# EAGLE board BMS_Master (EAGLE 7.2.0)
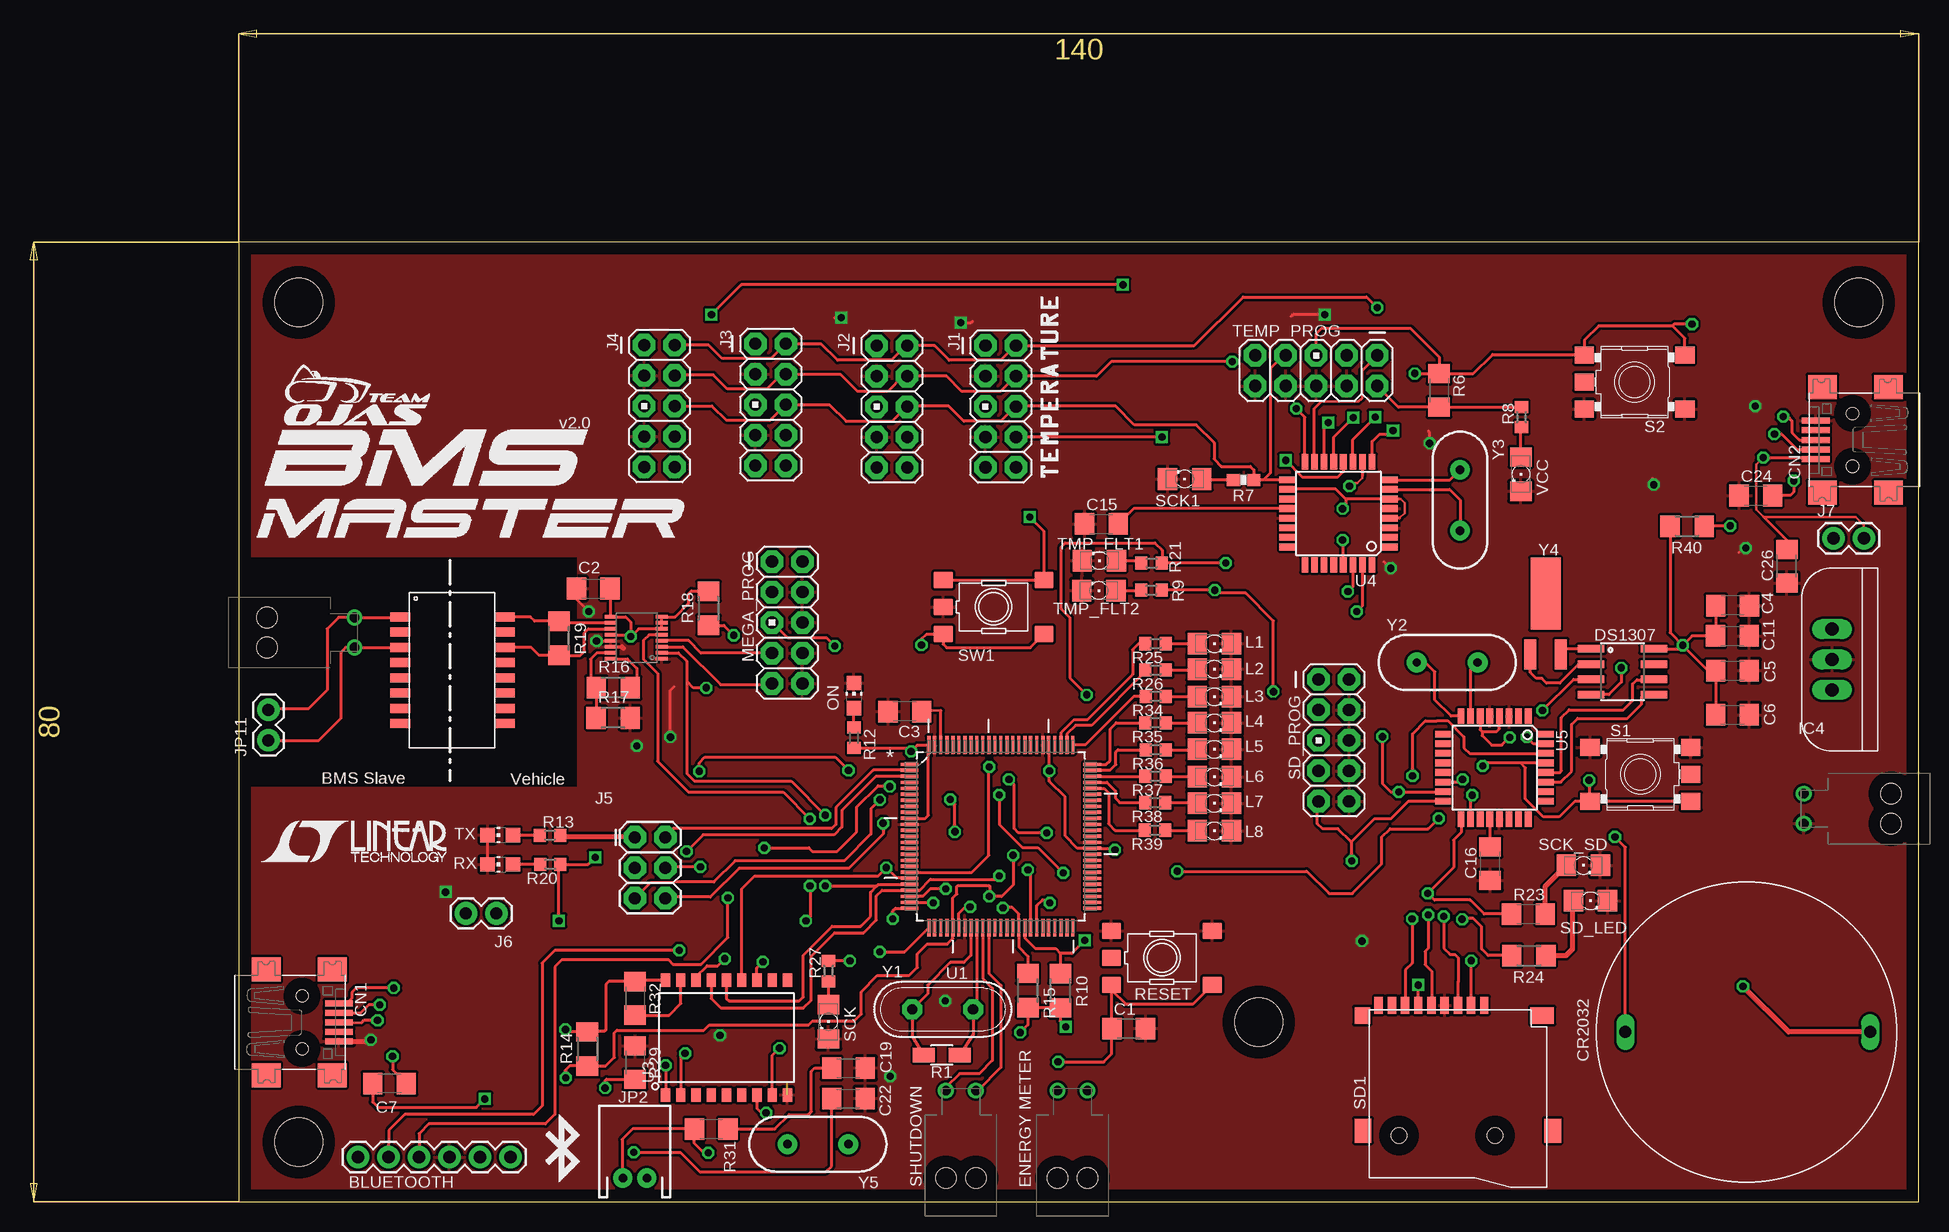
[diagram p5: board, top side]
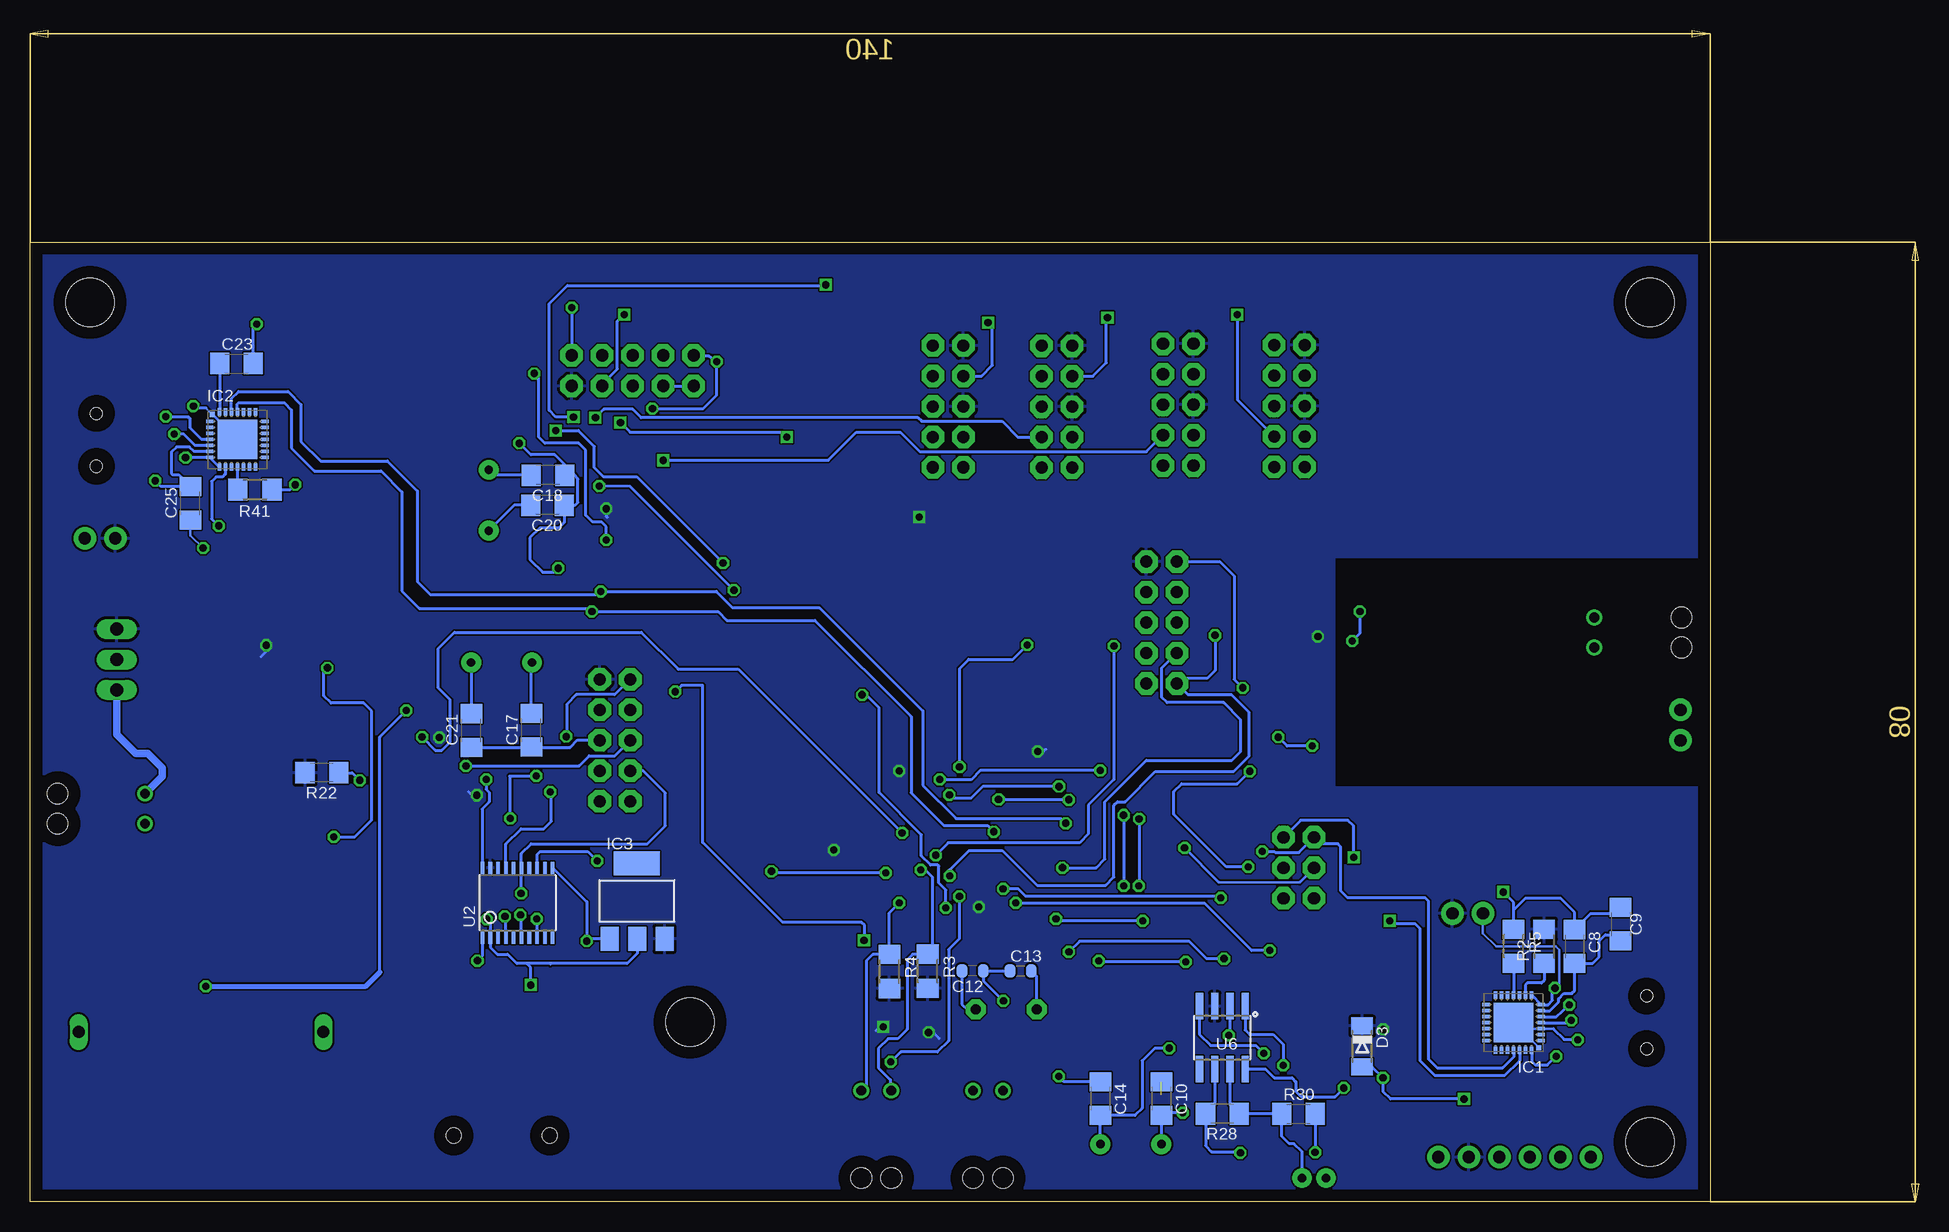
[diagram p6: board, bottom side, seen from below]

Size 140 x 80 mm. Coordinates in mm from the lower left corner, seen from the top.
Outline: 0,0 140,0 140,80 0,80 0,0
Copper layers (1*16): Top 0.035mm / dielectric 1.5mm / Bottom 0.035mm
Design rules "default *": minimum track width 0.253mm, minimum drill 0.59mm, track to track 6mil, track to pad 6mil, pad to pad 6mil, via to via 6mil, smd to smd 6mil, copper to edge 40mil, drill to drill 8mil, minimum pad ring 10mil, minimum via ring 8mil, stop-mask expansion 4mil, vias tented up to drill 0mil, thermal gap 10mil
Net classes: 1 vcc: width 0.254 mm; 2 gnd: width 0.305 mm, drill 0.406 mm, clearance 0.203 mm; 3 power usb: width 0.508 mm, drill 0.406 mm, clearance 0.203 mm
Holes 4 mm at 5,5 135,75 5,75 85,15

## Footprints (pad centres in the part's own frame; a part is rotated, then mirrored left to right if it is on the bottom)
1X06 = drill 1.016 pad 1.88: 1 0,0; 2 2.54,0; 3 5.08,0; 4 7.62,0; 5 10.16,0; 6 12.7,0
C1206 = smd 1.6 x 1.8: 1 -1.4,0; 2 1.4,0
1206 = smd 1.6 x 1.8: 1 -1.4,0; 2 1.4,0
C0603-ROUND = smd 0.898 x 1.1: 1 -0.889,0; 2 0.889,0
USB-MINIB = smd 0.5 x 2.308: D+ 0,4.064; D- -0.8,4.064; GND 1.6,4.064; ID 0.8,4.064; VBUS -1.6,4.064 | smd 2 x 2.4: GND1 -4.4,-2; GND2 -4.4,3.5; GND3 4.4,3.5; GND4 4.4,-2 | hole 1: -2.2,1; 2.2,1
CR2032 = drill 1 long: P$1 -10.3,0; P$2 10.1,0
MINIMELF = smd 1.4 x 1.8: A 1.7,0; C -1.7,0
SO08 = smd 0.61 x 2.21: 1 -1.905,-2.616; 2 -0.635,-2.616; 3 0.635,-2.616; 4 1.905,-2.616; 5 1.905,2.616; 6 0.635,2.616; 7 -0.635,2.616; 8 -1.905,2.616
MLP28 = smd 0.6 x 0.3: 1 -2.3,1.5; 2 -2.3,1; 3 -2.3,0.5; 4 -2.3,0; 5 -2.3,-0.5; 6 -2.3,-1; 7 -2.3,-1.5; 15 2.3,-1.5; 16 2.3,-1; 17 2.3,-0.5; 18 2.3,0; 19 2.3,0.5; 20 2.3,1; 21 2.3,1.5 | smd 0.3 x 0.6: 8 -1.5,-2.3; 9 -1,-2.3; 10 -0.5,-2.3; 11 0,-2.3; 12 0.5,-2.3; 13 1,-2.3; 14 1.5,-2.3; 22 1.5,2.3; 23 1,2.3; 24 0.5,2.3; 25 0,2.3; 26 -0.5,2.3; 27 -1,2.3; 28 -1.5,2.3 | smd 3.3 x 3.3: EXP 0,0 | smd 0.435 x 0.435: M -2.103,2.103
SOT223 = smd 1.499 x 2.007: 1 -2.261,-3.15; 2 0.025,-3.15; 3 2.311,-3.15 | smd 3.81 x 2.007: 4 0,3.15
TO220H = drill 1.118 long: 1 -2.54,0; 2 0,0; 3 2.54,0
AVR_ICSP = drill 1.016 pad 1.88 octagon: 1 -1.27,5.08; 2 1.27,5.08; 3 -1.27,2.54; 4 1.27,2.54; 5 -1.27,0; 6 1.27,0; 7 -1.27,-2.54; 8 1.27,-2.54; 9 -1.27,-5.08; 10 1.27,-5.08
2X3 = drill 1.016 pad 1.88 octagon: 1 0,0; 2 0,2.54; 3 2.54,0; 4 2.54,2.54; 5 5.08,0; 6 5.08,2.54
1X02 = drill 1.016 pad 1.88: 1 0,0; 2 2.54,0
JST-2-PTH = drill 0.7 pad 1.6: 1 -1,0; 2 1,0
LED_1206 = smd 1.6 x 1.803: A -1.422,0; C 1.422,0
CHIP-LED0805 = smd 1.2 x 1.2: A 0,-1.05; C 0,1.05
R1206W = smd 1.8 x 1.2: 1 -1.499,0; 2 1.499,0
R1206 = smd 1.6 x 1.803: 1 -1.422,0; 2 1.422,0
0603-RES = smd 1.1 x 1: 1 -0.85,0; 2 0.85,0
R0603 = smd 1 x 1.1: 1 -0.85,0; 2 0.85,0
TS42 = smd 1.6 x 1.4: 1 -4.2,2.25; 2 4.2,2.25; 3 -4.2,-2.25; 4 4.2,-2.25; 5 -4.2,0
SKHMPXE010 = smd 1.6 x 1.4: 1 -4.2,2.25; 2 4.2,2.25; 3 -4.2,-2.25; 4 4.2,-2.25; 5 4.2,0
TF-PULL = smd 0.7 x 1.4: 1 -2.2,-7.62; 2 -1.1,-7.62; 3 0,-7.62; 4 1.1,-7.62; 5 2.2,-7.62; 6 3.3,-7.62; 7 4.4,-7.62; 8 5.5,-7.62; 9 6.6,-7.62 | smd 1.4 x 2: S1 -7.9,2.85; S2 7.9,2.85 | smd 1.28 x 1.4: S3 7.96,-6.75 | smd 1.95 x 1.4: S4 -7.025,-6.75 | hole 1.25: -3.1,3.25; 4.9,3.25
QFP50P1600X1600X120-100N = smd 1.473 x 0.279: 1 -7.62,5.994; 2 -7.62,5.512; 3 -7.62,5.004; 4 -7.62,4.496; 5 -7.62,3.988; 6 -7.62,3.505; 7 -7.62,2.997; 8 -7.62,2.489; 9 -7.62,2.007; 10 -7.62,1.499; 11 -7.62,0.991; 12 -7.62,0.508; 13 -7.62,0; 14 -7.62,-0.508; 15 -7.62,-0.991; 16 -7.62,-1.499; 17 -7.62,-2.007; 18 -7.62,-2.489; 19 -7.62,-2.997; 20 -7.62,-3.505; 21 -7.62,-3.988; 22 -7.62,-4.496; 23 -7.62,-5.004; 24 -7.62,-5.512; 25 -7.62,-5.994; 51 7.62,-5.994; 52 7.62,-5.512; 53 7.62,-5.004; 54 7.62,-4.496; 55 7.62,-3.988; 56 7.62,-3.505; 57 7.62,-2.997; 58 7.62,-2.489; 59 7.62,-2.007; 60 7.62,-1.499; 61 7.62,-0.991; 62 7.62,-0.508; 63 7.62,0; 64 7.62,0.508; 65 7.62,0.991; 66 7.62,1.499; 67 7.62,2.007; 68 7.62,2.489; 69 7.62,2.997; 70 7.62,3.505; 71 7.62,3.988; 72 7.62,4.496; 73 7.62,5.004; 74 7.62,5.512; 75 7.62,5.994 | smd 0.279 x 1.473: 26 -5.994,-7.62; 27 -5.512,-7.62; 28 -5.004,-7.62; 29 -4.496,-7.62; 30 -3.988,-7.62; 31 -3.505,-7.62; 32 -2.997,-7.62; 33 -2.489,-7.62; 34 -2.007,-7.62; 35 -1.499,-7.62; 36 -0.991,-7.62; 37 -0.508,-7.62; 38 0,-7.62; 39 0.508,-7.62; 40 0.991,-7.62; 41 1.499,-7.62; 42 2.007,-7.62; 43 2.489,-7.62; 44 2.997,-7.62; 45 3.505,-7.62; 46 3.988,-7.62; 47 4.496,-7.62; 48 5.004,-7.62; 49 5.512,-7.62; 50 5.994,-7.62; 76 5.994,7.62; 77 5.512,7.62; 78 5.004,7.62; 79 4.496,7.62; 80 3.988,7.62; 81 3.505,7.62; 82 2.997,7.62; 83 2.489,7.62; 84 2.007,7.62; 85 1.499,7.62; 86 0.991,7.62; 87 0.508,7.62; 88 0,7.62; 89 -0.508,7.62; 90 -0.991,7.62; 91 -1.499,7.62; 92 -2.007,7.62; 93 -2.489,7.62; 94 -2.997,7.62; 95 -3.505,7.62; 96 -3.988,7.62; 97 -4.496,7.62; 98 -5.004,7.62; 99 -5.512,7.62; 100 -5.994,7.62
TSSOP20 = smd 0.305 x 0.991: 1 -2.925,-2.918; 2 -2.275,-2.918; 3 -1.625,-2.918; 4 -0.975,-2.918; 5 -0.325,-2.918; 6 0.325,-2.918; 7 0.975,-2.918; 8 1.625,-2.918; 9 2.275,-2.918; 10 2.925,-2.918; 11 2.925,2.918; 12 2.275,2.918; 13 1.625,2.918; 14 0.975,2.918; 15 0.325,2.918; 16 -0.325,2.918; 17 -0.975,2.918; 18 -1.625,2.918; 19 -2.275,2.918; 20 -2.925,2.918
SO-18W = smd 0.762 x 1.143: 1 -5.08,-4.788; 2 -3.81,-4.788; 3 -2.54,-4.788; 4 -1.27,-4.788; 5 0,-4.788; 6 1.27,-4.788; 7 2.54,-4.788; 8 3.81,-4.788; 9 5.08,-4.788; 10 5.08,4.788; 11 3.81,4.788; 12 2.54,4.788; 13 1.27,4.788; 14 0,4.788; 15 -1.27,4.788; 16 -2.54,4.788; 17 -3.81,4.788; 18 -5.08,4.788
TQFP32-08 = smd 1.27 x 0.559: 1 -4.293,2.8; 2 -4.293,2; 3 -4.293,1.2; 4 -4.293,0.4; 5 -4.293,-0.4; 6 -4.293,-1.2; 7 -4.293,-2; 8 -4.293,-2.8; 17 4.293,-2.8; 18 4.293,-2; 19 4.293,-1.2; 20 4.293,-0.4; 21 4.293,0.4; 22 4.293,1.2; 23 4.293,2; 24 4.293,2.8 | smd 0.559 x 1.27: 9 -2.8,-4.293; 10 -2,-4.293; 11 -1.2,-4.293; 12 -0.4,-4.293; 13 0.4,-4.293; 14 1.2,-4.293; 15 2,-4.293; 16 2.8,-4.293; 25 2.8,4.293; 26 2,4.293; 27 1.2,4.293; 28 0.4,4.293; 29 -0.4,4.293; 30 -1.2,4.293; 31 -2,4.293; 32 -2.8,4.293
MOLEX_2PIN = drill 0.8 pad 1.2: P$1 1.72,10.48; P$2 4.22,10.48 | hole 1.7: 1.72,3.2; 4.22,3.2
LTC6820 = smd 0.305 x 1: 1 1.711,2.235; 2 1.211,2.235; 3 0.711,2.235; 4 0.211,2.235; 5 -0.289,2.235; 6 -0.789,2.235; 7 -1.289,2.235; 8 -1.789,2.235; 9 -1.789,-2.015; 10 -1.289,-2.015; 11 -0.789,-2.015; 12 -0.289,-2.015; 13 0.211,-2.015; 14 0.711,-2.015; 15 1.211,-2.015; 16 1.711,-2.015
HX1188 = smd 1.651 x 0.762: 1 -4.318,4.318; 2 -4.318,3.048; 3 -4.318,1.778; 4 -4.318,0.508; 5 -4.318,-0.762; 6 -4.318,-2.032; 7 -4.318,-3.302; 8 -4.318,-4.572; 9 4.402,-4.572; 10 4.402,-3.302; 11 4.402,-2.032; 12 4.402,-0.762; 13 4.402,0.508; 14 4.402,1.778; 15 4.402,3.048; 16 4.372,4.318
QS = drill 0.85 pad 1.676 octagon: 1 -2.54,0; 2 2.54,0
HC49US = drill 0.7 pad 1.651: 1 -2.54,0; 2 2.54,0
CRYSTAL-32KHZ-SMD = smd 2.5 x 6: SHEILD 0,5.08 | smd 1 x 2.5: X1 -1.27,0; X2 1.27,0

## Placement (x,y rotation side)
BLUETOOTH  [1X06]  22.63,3.74 180 top
C1  22p  [C1206]  74.16,14.46 0 top
C2  100n  [C1206]  29.54,51.14 0 top
C3  100n  [C1206]  55.5,40.88 180 top
C4  100n  [C1206]  124.46,47.19 0 top
C5  100n  [C1206]  124.47,44.29 0 top
C6  100n  [C1206]  124.48,40.61 0 top
C7  0.1uF  [C1206]  12.56,9.87 180 top
C8  0.1uF  [C1206]  11.29,21.3 270 bottom
C9  4.7uF  [C1206]  7.45,23.16 270 bottom
C10  22pF  [1206]  45.72,8.62 270 bottom
C11  100n  [C1206]  124.48,49.71 180 top
C12  15p  [C0603-ROUND]  61.45,19.26 180 bottom
C13  15p  [C0603-ROUND]  57.44,19.26 0 bottom
C14  22pF  [1206]  50.8,8.62 270 bottom
C15  0.1uF  [1206]  71.88,56.52 0 top
C16  0.1uF  [1206]  104.28,28.2 90 top
C17  22pF  [1206]  98.22,39.32 90 bottom
C18  22pF  [1206]  96.84,60.58 180 bottom
C19  560pF  [1206]  50.8,11.16 0 top
C20  22pF  [1206]  96.88,58.08 180 bottom
C21  22pF  [1206]  103.22,39.3 90 bottom
C22  560pF  [1206]  50.8,8.62 0 top
C23  0.1uF  [C1206]  122.79,69.9 0 bottom
C24  0.1uF  [C1206]  126.42,58.89 0 top
C25  4.7uF  [C1206]  126.63,58.24 90 bottom
C26  4.7uF  [C1206]  129,53 90 top
CN1  [USB-MINIB]  4.28,14.97 270 top
CN2  [USB-MINIB]  135.47,63.53 90 top
CR2032  CR2032  [CR2032]  125.65,14.17 180 top
D3  CD1206-S01575  [MINIMELF]  28.99,12.97 270 bottom
DS1307  DS1307SO8  [SO08]  115.3,44.2 270 top
IC1  CP2102  [MLP28]  16.37,14.95 180 bottom
IC2  CP2102  [MLP28]  122.71,63.56 0 bottom
IC3  REG1117  [SOT223]  89.43,25.08 0 bottom
IC4  7805T  [TO220H]  132.77,45.22 90 top
J1  [AVR_ICSP]  63.49,66.31 0 top
J2  [AVR_ICSP]  54.43,66.3 0 top
J3  [AVR_ICSP]  44.31,66.47 0 top
J4  [AVR_ICSP]  35.05,66.35 0 top
J5  FEMALE 2x3  [2X3]  33,30.39 270 top
J6  [1X02]  21.46,24.05 180 top
J7  [1X02]  132.89,55.32 0 top
JP2  [JST-2-PTH]  33,2 0 top
JP11  [1X02]  2.46,38.48 90 top
L1  [LED_1206]  81.3,46.54 0 top
L2  [LED_1206]  81.3,44.42 0 top
L3  [LED_1206]  81.3,42.12 0 top
L4  [LED_1206]  81.3,39.94 0 top
L5  [LED_1206]  81.3,37.74 0 top
L6  [LED_1206]  81.3,35.44 0 top
L7  [LED_1206]  81.3,33.24 0 top
L8  [LED_1206]  81.3,30.94 0 top
MEGA_PROG  AVR_SPI_PROG  [AVR_ICSP]  45.7,48.3 0 top
ON  GREEN  [CHIP-LED0805]  51.26,42.21 0 top
R1  1M  [R1206W]  58.58,12.24 180 top
R2  4.7k  [R1206]  13.83,21.3 90 bottom
R3  1k  [R1206]  65.19,19.23 270 bottom
R4  1k  [R1206]  68.39,19.21 270 bottom
R5  10k  [R1206]  16.37,21.3 270 bottom
R6  10K  [1206]  100.02,67.66 270 top
R7  330  [0603-RES]  83.74,60.18 180 top
R8  330  [R0603]  106.89,65.43 90 top
R9  330  [R0603]  76.05,51.01 0 top
R10  1k  [R1206]  68.46,17.61 270 top
R12  1k  [R0603]  51.26,38.69 270 top
R13  1k  [R0603]  25.93,30.56 0 top
R14  10k  [R1206]  29.04,12.75 90 top
R15  1k  [R1206]  65.76,17.63 270 top
R16  806  [R1206]  31.21,42.87 0 top
R17  1.2k  [R1206]  31.19,40.35 0 top
R18  2k  [R1206]  39.14,49.49 90 top
R19  120  [R1206]  26.67,46.99 270 top
R20  1k  [R0603]  25.95,28.14 180 top
R21  330  [R0603]  76.07,53.26 0 top
R22  10K  [1206]  115.68,35.78 180 bottom
R23  330  [1206]  107.46,24 0 top
R24  330  [R1206]  107.51,20.54 180 top
R25  330  [R0603]  76.4,46.54 180 top
R26  330  [R0603]  76.4,44.34 180 top
R27  330  [R0603]  49.14,19.25 90 top
R28  120  [1206]  40.64,7.35 180 bottom
R29  1k  [1206]  33.02,11.62 270 top
R30  1k  [1206]  34.29,7.35 0 bottom
R31  1k  [1206]  39.37,6.08 0 top
R32  10k  [1206]  33.02,16.97 270 top
R34  330  [R0603]  76.41,42.14 180 top
R35  330  [R0603]  76.39,39.94 180 top
R36  330  [R0603]  76.41,37.69 180 top
R37  330  [R0603]  76.39,35.49 180 top
R38  330  [R0603]  76.37,33.29 180 top
R39  330  [R0603]  76.35,30.99 180 top
R40  4.7k  [R1206]  120.69,56.34 180 top
R41  10k  [R1206]  121.26,59.39 180 bottom
RESET  TS42031-160R-TR-7260  [TS42]  76.92,20.35 0 top
RX  YELLOW  [CHIP-LED0805]  21.79,28.14 90 top
S1  SKHMPWE010  [SKHMPXE010]  116.8,35.65 0 top
S2  SKHMPWE010  [SKHMPXE010]  116.31,68.35 180 top
SCK  [LED_1206]  49.14,15.02 270 top
SCK1  [LED_1206]  78.82,60.26 180 top
SCK_SD  [LED_1206]  112.05,28.06 0 top
SD1  TF-HOLDER  [TF-PULL]  101.59,8.78 180 top
SD_LED  [LED_1206]  112.64,25.11 0 top
SD_PROG  AVR_SPI_PROG  [AVR_ICSP]  91.25,38.48 0 top
SW1  TS42031-160R-TR-7260  [TS42]  62.9,49.6 0 top
TEMP_PROG  AVR_SPI_PROG  [AVR_ICSP]  89.78,69.3 270 top
TMP_FLT1  [LED_1206]  71.72,53.46 180 top
TMP_FLT2  [LED_1206]  71.67,50.96 180 top
TX  YELLOW  [CHIP-LED0805]  21.79,30.59 90 top
U1  ATMEGA2560-16AU  [QFP50P1600X1600X120-100N]  63.5,30.48 0 top
U2  [TSSOP20]  99.37,24.94 0 bottom
U3  MCP2515  [SO-18W]  40.64,13.7 0 top
U4  ATMEGA328  [TQFP32-08]  91.64,57.4 180 top
U5  ATMEGA328  [TQFP32-08]  104.65,36.2 270 top
U6  MCP2551  [SO08]  40.64,13.7 180 bottom
U$1  MOLEX_2_PIN  [MOLEX_2PIN]  66.51,-1.2 0 top
U$3  LTC6820  [LTC6820]  33.02,46.99 270 top
U$4  HX1188N  [HX1188]  17.78,44.45 0 top
U$5  MOLEX_2_PIN  [MOLEX_2PIN]  -0.84,50.44 270 top
U$6  MOLEX_2_PIN  [MOLEX_2PIN]  140.89,29.82 90 top
U$7  MOLEX_2_PIN  [MOLEX_2PIN]  57.2,-1.2 0 top
VCC  [LED_1206]  106.84,60.67 270 top
Y1  16MHz  [QS]  58.65,16.05 0 top
Y2  [HC49US]  100.7,44.97 0 top
Y3  [HC49US]  101.77,58.5 270 top
Y4  [CRYSTAL-32KHZ-SMD]  108.9,45.64 0 top
Y5  [HC49US]  48.26,4.81 180 top

## Tracks (layer width: path | path; a pad name or v marks a point on that pad's centre or on a via)
+3.3V  (via drill 0.6)
  Top 0.254: R24.2 104.1,20.54 103.56,21.08 103.56,22.94 102.88,23.62 101.99,23.62 v101.94,23.57 | SD1.6 v98.29,18.07 v98.28,18.08
  Bottom 0.254: IC3.2 89.41,20.71 90.24,19.88 96.58,19.88 | 96.58,19.88 98.61,19.88 | 98.61,19.88 99.43,19.88 100.19,20.64 101.05,20.64 101.65,21.23 U2.2 101.65,23.28 v101.94,23.57 | 96.64,19.82 96.58,19.88 | v98.28,18.08 98.28,19.55 98.61,19.88
A4SD
  Top 0.254: U5.27 110.17,35 111.06,35.89 111.06,39.81 111.57,40.32 115.71,40.32 116.9,41.51 116.9,42.06 117.13,42.29 DS1307.5
A5SD
  Top 0.254: U5.28 110.09,35.8 110.22,35.93 110.22,40.38 110.87,41.03 115.39,41.03 116.16,41.8 116.16,43.18 116.51,43.53 117.88,43.53 DS1307.6
AREF
  Top 0.254: U1.98 58.5,40.97 C3.1
AREF1
  Top 0.254: U4.20 74.56,57.8 C15.2
AREF1SD
  Top 0.254: U5.20 104.25,29.63 C16.2
CANH
  Bottom 0.254: U6.7 40,8.11 R28.1 R30.1 35.7,5.48 35.08,4.86 34.68,4.86 34,4.18 JP2.2
CANL  (via drill 0.6)
  Top 0.254: v39.13,4.09 38.76,4.09 37.97,4.88 R31.1 32.81,6.08 31.95,5.22 31.95,2.05 JP2.1
  Bottom 0.254: U6.6 41.28,8.11 R28.2 42.04,4.68 41.56,4.2 39.24,4.2 v39.13,4.09
CSSD1  (via drill 0.6)
  Top 0.254: SD1.2 102.71,16.4 v102.71,20.11
  Bottom 0.254: U2.1 102.29,20.53 v102.71,20.11
D7  (via drill 0.6)
  Top 0.254: U4.11 92.84,63.57 v94.71,65.43 | v73.68,76.46 41.88,76.46 v39.39,73.97
  Bottom 0.254: J4.8 37.22,64.71 37.54,65.03 39.39,66.88 v39.39,73.97 | v94.71,65.43 96.18,65.43 96.74,65.99 96.74,74.88 95.22,76.41 73.73,76.41 v73.68,76.46
D8  (via drill 0.6)
  Top 0.254: U4.12 92.04,60.89 91.56,60.41 88.66,60.41 v87.24,61.83
  Bottom 0.254: J3.8 46.97,62.54 65.85,62.54 67.48,64.16 71.14,64.16 73.47,61.83 v87.24,61.83
D9  (via drill 0.6)
  Top 0.254: U4.13 91.24,63.75 v92.88,65.38
  Bottom 0.254: J2.8 57.67,63.76 59,65.08 65.7,65.08 66,65.38 89.07,65.38 89.78,66.09 92.17,66.09 v92.88,65.38
D10  (via drill 0.6)
  Top 0.254: U4.14 90.44,64.62 v90.8,64.98 | v76.93,63.76 64.78,63.76 J1.8
  Bottom 0.254: v90.8,64.98 89.98,64.16 77.33,64.16 v76.93,63.76
D10SD  (via drill 0.6)
  Top 0.254: U5.14 101.75,35 v101.98,35.23
  Bottom 0.254: v101.98,35.23 101.98,34.39 101.73,34.14 101.73,33.35 102.32,32.76 102.32,27.88 U2.20
D+  (via drill 0.6)
  Top 0.254: v11.56,15.13 10.42,15.13 10.24,14.95 CN1.D+
  Bottom 0.254: IC1.4 11.74,14.95 v11.56,15.13
D+1  (via drill 0.6)
  Top 0.254: v128.7,65.46 129.1,65.46 129.43,65.13 129.43,64.14 130.04,63.53 CN2.D+
  Bottom 0.254: IC2.4 125.69,63.56 126.66,64.53 126.66,65.31 126.8,65.45 v128.69,65.45 v128.7,65.46
D-  (via drill 0.6)
  Top 0.254: v11.74,16.44 10.83,16.44 10.13,15.74 7.74,15.74 CN1.D-
  Bottom 0.254: IC1.5 12.81,15.45 v11.74,16.44
D-1  (via drill 0.6)
  Top 0.254: v127.97,64.02 128.56,64.02 129.86,62.72 131.4,62.72 CN2.D-
  Bottom 0.254: IC2.5 126.23,63.06 127.17,64 127.95,64 v127.97,64.02
GND  (via drill 0.6)  (1 unrouted)
  Top 0.203: v125.58,54.51 125.37,54.51 124.99,54.13
  Top 0.254: 33.17,38.03 v33.15,38.01 | v35.97,38.75 35.97,42.65 36.26,42.94 | C2.1 28.14,50.25 v29.17,49.22 | v29.81,46.76 30.99,46.76 U$3.13 | RX.C TX.C | v117.9,59.79 117.9,60.22 117.8,60.32 | v126.38,66.34 126.38,66.58 126.3,66.66 | v17.23,25.83 17.52,25.83 | v95.99,52.83 95.45,53.37 | v99.23,63.25 99.23,64.16 99.13,64.27 | v90.49,73.97 87.85,73.97 87.7,73.82 | v60.16,73.31 61.03,73.31 61.13,73.41 | v50.21,73.71 49.65,73.71
  Top 0.305: U$3.14 31.93,46.28
  Top 0.406: 31.93,46.28 32.06,46.15 | CN1.GND 10.86,13.37 v11.01,13.52
  Bottom 0.203: 14.95,14.45 IC1.3 13.06,14.45 | 14.27,12.88 15.02,13.63 15.02,14.38 | IC2.EXP 125.34,66.2 | C25.1 126.63,55.56 v125.58,54.51
  Bottom 0.254: R5.1 16.37,24.33 | 16.37,24.33 15.36,25.34 12.48,25.34 11.29,24.13 C8.1 9.94,24.05 7.96,24.05 C9.1 | IC1.EXP 15.87,14.45 14.95,14.45 15.02,14.38 | IC1.M 14.27,12.88 | 13.06,14.45 12.16,13.55 11.04,13.55 v11.01,13.52 | U6.2 40,13.96 v40.1,13.89 | C14.1 53.84,10.02 v54.28,10.46 | C13.1 C12.1 60.56,18.44 v58.88,16.76 | IC3.1 93.42,21.93 v93.6,21.75 93.6,25.01 U2.11 | C17.1 98.24,37.9 C21.1 94.98,37.9 94.38,38.5 92.54,38.5 SD_PROG.6 | v33.15,38.01 35.23,38.01 v35.97,38.75 | v29.17,49.22 29.17,47.4 v29.81,46.76 | TEMP_PROG.8 TEMP_PROG.10 | R41.1 118.3,59.39 v117.9,59.79 | IC2.M IC2.EXP | 125.34,66.2 126.24,66.2 v126.38,66.34 | 16.37,24.33 16.37,24.97 v17.23,25.83 | v95.99,52.83 96.32,52.5 97.28,52.5 98.35,53.57 98.35,55.37 97.52,56.2 U4.3 95.48,56.65 C20.1 94.57,58.08 94.34,58.32 94.34,60.25 94.67,60.58 | 94.67,60.58 C18.1 | 94.67,60.58 94.67,60.67 96.28,62.28 98.26,62.28 v99.23,63.25 | TEMP_PROG.4 92.32,68.18 91.05,69.45 91.05,73.41 v90.49,73.97 | J1.3 60.7,68.85 59.81,69.75 59.81,72.95 v60.16,73.31 | J2.3 51.42,68.84 50.31,69.95 50.31,73.61 v50.21,73.71
  pour Top: -3,85.4 142.5,85.1 142.92,-6.64 -1.68,-6.64 -2.3,34.5 28.32,34.5 28.32,53.86 -3,53.8
IM
  Top 0.254: U$3.10 26.8,48.28 R19.1 24.66,48.41 24.3,48.77 U$4.16
IMA
  Top 0.254: 13.37,48.67 U$4.1 13.42,48.72 U$5.P$1 8.31,48.72 7.37,47.78 7.37,42.67 5.79,41.1 2.54,41.1 JP11.2
INPUT
  Bottom 0.61: U$6.P$2 128.98,35.47 128.98,36.17 130.2,37.39 131.19,37.39 132.77,38.97 IC4.1
INT_CAN  (via drill 0.6)
  Top 0.254: U3.12 43.18,19.51 v43.68,20.01 | v50.93,20.09 R27.2
  Bottom 0.254: v43.68,20.01 50.85,20.01 v50.93,20.09
IP
  Top 0.254: U$4.14 24.36,46.23 25.02,45.57 R19.2 28.47,45.57 28.8,45.9 28.8,47.44 29.14,47.78 U$3.11
IPA
  Top 0.254: U$4.3 U$5.P$2 8.91,46.22 8.51,45.82 8.51,40.31 6.63,38.43 2.52,38.43 JP11.1
MISO  (via drill 0.6)
  Top 0.254: U4.16 88.84,65.42 v88.13,66.13 | v82.78,70.05 72.7,70.05 71.49,68.84 64.78,68.84 | 64.78,68.84 J1.4 | 64.78,68.84 64.74,68.84 63.47,67.57 60.27,67.57 59,68.84 J2.4 | J2.4 | J2.4 55.34,68.84 54.07,67.57 51.58,67.57 50.16,68.99 45.6,68.99 J3.4 45.25,69.01 44.01,67.77 40.71,67.77 39.54,68.94 36.37,68.94 J4.4
  Bottom 0.254: v88.13,66.13 83.9,66.13 82.78,67.25 v82.78,70.05 83.41,70.52 84.65,70.52 TEMP_PROG.9
MISOSD  (via drill 0.6)
  Top 0.254: v92.74,28.42 92.74,29.96 92.69,30.01 | 92.69,30.01 91.59,31.11 90.31,31.11 89.89,31.53 89.89,33.31 SD_PROG.9 | U5.16 97.46,33.4 96.01,31.95 94.63,31.95 92.69,30.01
  Bottom 0.254: U2.13 97.75,28.96 97.49,29.22 93.54,29.22 v92.74,28.42
MISOSD1  (via drill 0.6)
  Top 0.254: v97.77,23.6 97.77,19.89 97.21,19.33 97.21,16.42 SD1.7
  Bottom 0.254: U2.8 97.75,23.57 v97.77,23.6
MOSI  (via drill 0.6)
  Top 0.203: 93.61,67.18 93.61,67.02 93.29,66.7 90.19,66.7
  Top 0.254: U4.15 89.64,66.14 90.19,66.7 | 93.61,67.18 93.61,69.32 TEMP_PROG.1 | v94.86,74.56 93.98,75.44 83.68,75.44 79.64,71.39 J1.2 63.52,70.16 59.2,70.16 57.98,71.38 J2.2 55.59,71.38 54.37,70.16 49.9,70.16 48.53,71.53 45.6,71.53 J3.2 45.55,71.55 44.31,70.31 40.3,70.31 39.18,71.43 J4.2
  Bottom 0.254: v94.86,74.56 TEMP_PROG.1
MOSISD  (via drill 0.6)
  Top 0.254: U5.15 100.33,34.17 v96.65,34.17 96.62,34.2 95.98,34.2 95.3,34.88 v95.3,38.79
  Bottom 0.254: U2.17 100.34,29.83 99.07,31.11 97.17,31.11 96.55,31.73 96.55,34.07 v96.65,34.17 | SD_PROG.1 90.01,43.56 91.28,42.29 94.46,42.29 95.27,41.48 95.28,38.77 v95.3,38.79
MOSISD1  (via drill 0.6)
  Top 0.254: v100.42,23.81 100.42,21.15 100.94,20.63 101.33,20.63 101.6,20.36 101.6,18.36 101.59,18.36 SD1.3
  Bottom 0.254: U2.4 100.34,23.73 v100.42,23.81
N$1
  Top 0.254: R20.2 RX.A
N$2
  Top 0.254: R13.1 22.87,30.56 TX.A
N$3
  Top 0.254: R12.1 ON.A
N$4
  Top 0.254: R27.1 SCK.A
N$5  (via drill 0.6)
  Top 0.254: U3.8 44.45,12.21 v45.06,12.82
  Bottom 0.254: Y5.1 C14.2 47.92,7.21 47.32,7.81 47.32,11.77 46.27,12.82 v45.06,12.82
N$6  (via drill 0.6)
  Top 0.254: U3.7 43.18,7.8 43.53,7.45 v43.93,7.45 v43.94,7.44
  Bottom 0.254: v43.94,7.44 45.5,7.44 C10.2 Y5.2
N$7
  Top 0.254: U$3.16 32.37,45.28 33.17,44.48 33.17,43.18 R16.2
N$8
  Top 0.254: U$3.15 29.85,45.78 29.32,45.25 29.32,43.34 R16.1 R17.1
N$9  (via drill 0.6)
  Top 0.254: v30.52,9.5 30.52,10.12 30.63,10.23 R29.2
  Bottom 0.254: U6.8 37.04,11.08 36.31,10.35 34.83,10.35 34.51,10.03 34.51,9.22 34.06,8.77 31.25,8.77 v30.52,9.5
N$12
  Top 0.254: DS1307.1 110.63,46.11 Y4.X2
N$13  (via drill 0.6)
  Top 0.254: v32.91,4.13 36.79,4.13 38.4,2.52 48.93,2.52 49.4,2.99 C22.1
  Bottom 0.254: R30.2 32.89,4.15 v32.91,4.13
N$14
  Top 0.254: DS1307.2 111.66,44.84 110.09,43.26 108.97,43.26 108.59,43.64 108.14,43.64 107.63,44.15 Y4.X1
N$15  (via drill 0.6)
  Top 0.254: CR2032.P$2 115.55,29.56 v114.68,30.43 | v115.21,44.53 115.21,43.33 114.17,42.29 DS1307.4
  Bottom 0.254: v114.68,30.43 112.93,30.43 111.53,31.83 111.53,40.92 112.19,41.58 114.91,41.58 115.52,42.19 115.52,44.22 v115.21,44.53
N$16
  Top 0.254: R31.2 44.67,6.08 45.86,7.27 47.44,7.27 47.72,7.55 47.72,10.88 48,11.16 C19.1
N$18  (via drill 0.6)
  Top 0.254: v12.81,12.15 12.81,11.02 C7.1
  Bottom 0.254: IC1.28 14.87,11.72 14.56,11.41 13.55,11.41 v12.81,12.15
N$19
  Bottom 0.254: R5.2 IC1.11
N$20
  Bottom 0.254: IC1.6 13.34,15.95 12.61,16.68 12.61,16.94 12.18,17.37 11.52,17.37 11.29,17.6 C8.2 9.79,19.9 9.24,20.45 9.24,21.76 8.72,22.28 7.46,22.28 C9.2
N$21
  Bottom 0.254: R2.1 13.83,18.48 14.05,18.26 15.22,18.26 15.39,18.09 15.39,17.27 IC1.9
N$23
  Top 0.254: R32.2 35.86,15.57 36.84,16.55 36.84,18.48 U3.17
N$24
  Top 0.254: R7.2 80.32,60.18 SCK1.A
N$25
  Top 0.254: R25.1 L1.A
N$26
  Top 0.254: R26.1 79.8,44.34 L2.A
N$27
  Top 0.254: VCC.A 106.84,64.53 R8.1
N$28
  Top 0.254: TMP_FLT2.A 75.15,50.96 R9.1
N$29
  Top 0.254: TMP_FLT1.A 75.02,53.46 R21.1
N$30
  Top 0.254: R23.2 108.94,23.92
  Top 0.406: R23.2 108.86,26.29 SCK_SD.A
N$31
  Top 0.406: R24.1 110.61,20.54 111.15,21.08 111.15,25.04 SD_LED.A
N$32
  Top 0.254: R34.1 79.86,42.14 L3.A
N$33
  Top 0.254: R35.1 L4.A
N$34
  Top 0.254: R36.1 79.83,37.69 L5.A
N$35
  Top 0.254: R37.1 79.83,35.49 L6.A
N$36
  Top 0.254: R38.1 79.83,33.29 L7.A
N$37
  Bottom 0.254: C23.1 124.19,65.88 IC2.28
N$38
  Top 0.254: R39.1 79.83,30.99 L8.A
N$39  (via drill 0.6)
  Top 0.254: v108.64,40.97 111.23,43.56 DS1307.3
  Top 0.406: CR2032.P$1 129.16,14.17 v125.35,17.98
  Bottom 0.254: 110.85,19.15 110.85,38.76 v108.64,40.97
  Bottom 0.406: v125.35,17.98 112.01,17.98 110.85,19.15
N$40  (via drill 0.6)
  Top 0.254: v129.57,60.12 129.57,59.17 129.3,58.9 C24.2
  Bottom 0.254: IC2.6 126.33,62.56 126.72,62.95 127.79,62.95 128.21,62.53 128.21,60.73 128.11,60.63 127.62,60.63 C25.2 129.09,59.64 v129.57,60.12
N$41  (via drill 0.6)
  Top 0.254: v124.28,56.36 122.13,56.36 R40.1
  Bottom 0.254: IC2.9 123.71,60.67 123.95,60.43 124.5,60.43 124.86,60.07 124.86,56.94 v124.28,56.36
N$42
  Bottom 0.254: IC2.11 122.71,59.42 R41.2
PA0
  Top 0.254: R25.2 74.98,46.54 74.49,46.05 74.49,43.98 70.71,40.2 69.59,40.2 68.5,39.11 U1.78
PA1
  Top 0.254: R26.2 75.55,44.22 71.07,39.74 69.73,39.74 69,39.01 69,38.11 U1.77
PA2
  Top 0.254: R34.2 74.58,42.14 70.54,38.1 U1.76
PA3
  Top 0.254: U1.75 72.3,36.47 72.6,36.77 72.6,39.42 73.12,39.94 R35.2
PA4
  Top 0.254: U1.74 72.61,35.99 73.08,36.46 73.08,37.5 73.27,37.69 R36.2
PA5
  Top 0.254: U1.73 R37.2
PA6
  Top 0.254: U1.72 72.33,34.98 73.04,34.27 73.04,33.66 73.41,33.29 R38.2
PA7
  Top 0.254: U1.71 72.11,34.47 72.48,34.1 72.48,31.52 73.01,30.99 R39.2
PB0  (via drill 0.6)
  Top 0.254: SW1.4 65.97,46.22 58.98,46.22 58.7,46.5 SW1.3 57.32,47.34 56.89,46.91 v56.89,46.43 | U1.19 61.08,27.48 62.5,28.9 62.5,36.22 v62.54,36.26
  Bottom 0.254: v62.54,36.26 62.54,44.47 61.78,45.23 58.09,45.23 v56.89,46.43
PB1  (via drill 0.6)
  Top 0.254: U3.13 41.91,26.09 42.97,27.15 53.25,27.15 v53.96,27.86 54.81,27.01 55.84,27.01 U1.20 | MEGA_PROG.7 38.51,45.76 37.48,46.79 U$3.4
  Bottom 0.254: v53.96,27.86 51.16,27.86 50.43,28.59 50.43,33.35 46.96,36.82 39.84,36.82 39.12,37.54 39.12,40.2 40.54,41.62 45.24,41.62 45.69,42.07 45.69,44.5 MEGA_PROG.7
PB2  (via drill 0.6)
  Top 0.254: U3.14 40.64,16.95 40.84,16.75 46.7,16.75 47.04,17.09 47.04,20.57 49.45,22.98 51.82,22.98 52.66,23.82 52.66,25.82 53.18,26.34 | U1.21 55.86,26.47 53.31,26.47 53.18,26.34 | U$3.2 36.64,45.78 37.33,45.09 37.33,43.42 | 37.33,43.42 37.33,35.72 37.97,35.08 46.03,35.08 v48.87,32.24 | v48.86,26.34 53.18,26.34 | v38.95,42.86 37.89,42.86 37.33,43.42
  Bottom 0.254: v48.87,32.24 v48.87,26.35 v48.86,26.34 | MEGA_PROG.1 40.84,53.38 39.65,52.19 39.65,43.56 v38.95,42.86
PB3  (via drill 0.6)
  Top 0.254: U3.15 39.37,16.96 40.17,16.16 47.05,16.16 47.69,16.8 47.69,20.47 49.66,22.44 52.06,22.44 53.13,23.51 53.13,25.5 53.62,25.99 U1.22 | 55.87,25.97 U1.22 | U$3.3 37,46.28 40.15,43.13 44.34,43.13 MEGA_PROG.9 | R18.1 40.42,48.07 v41.25,47.24 | U1.22 56.73,25.99 57.64,26.9 63.09,26.9 v63.36,27.17
  Bottom 0.254: v41.25,47.24 41.25,44.31 41.91,43.65 44,43.65 MEGA_PROG.9 43.48,42.27 39.86,42.27 38.4,40.81 38.4,37.17 39.7,35.87 46.22,35.87 48.73,33.36 49.36,33.36 49.68,33.04 49.68,27.09 50.37,26.4 56.08,26.4 58.98,29.3 61.74,29.3 63.36,27.68 v63.36,27.17
PB4  (via drill 0.6)
  Top 0.254: v40.76,25.35 40.76,22.05 38.52,19.81 36.18,19.81 35.83,20.16 26.91,20.16 26.34,19.59 26.34,7.3 25.55,6.51 15.84,6.51 15.02,5.69 15.02,3.76 BLUETOOTH.4 | v58.91,26.09 57.61,26.09 57,25.48 U1.23
  Bottom 0.254: v40.76,25.35 40.9,25.49 57.03,25.49 57.63,26.09 v58.91,26.09
PB5  (via drill 0.6)
  Top 0.254: v36.7,20.97 v36.69,20.98 26.34,20.98 25.27,19.91 25.27,8.01 24.56,7.3 13.83,7.3 12.5,5.97 BLUETOOTH.5 | v57.86,24.94 55.91,24.94 U1.24
  Bottom 0.254: v36.7,20.97 38.2,20.97 42.12,24.89 57.81,24.89 v57.86,24.94
PB6  (via drill 0.6)
  Top 0.254: U$3.5 34.19,47.28 33.72,46.81 33.72,45.26 34.91,44.07 34.91,36.73 37.47,34.17 45.35,34.17 v47.58,31.94 | v47.6,26.34 47.6,23.76 v47.26,23.42 | v54.5,23.59 54.5,24.25 54.74,24.49 U1.25
  Bottom 0.254: v47.58,31.94 47.58,26.36 v47.6,26.34 | v47.26,23.42 54.33,23.42 v54.5,23.59
PB7  (via drill 0.6)
  Top 0.254: v53.42,20.85 55.5,20.85 U1.26 | U3.16 38.1,18.77 39.03,19.7 39.92,19.7 v40.5,20.28
  Bottom 0.254: v53.42,20.85 52.53,21.74 43.4,21.74 41.94,20.28 v40.5,20.28
PL0
  Top 0.254: U1.35 62,18.62 62.8,17.82 62.8,11.79 61.71,10.7 60.06,10.7 58.92,9.56 U$7.P$1
PL1
  Top 0.254: U1.36 62.51,19.05 63.5,18.06 63.5,11.22 61.56,9.28 U$7.P$2
RESET  (via drill 0.6)
  Top 0.254: v27.25,10.35 27.25,10.9 27.19,10.96 27.57,11.33 R14.1 30.58,11.33 31.3,12.05 31.3,14.1 31.51,14.31 38.76,14.31 39.21,14.76 47.49,14.76 47.81,15.08 51.29,15.08 51.88,15.67 51.88,17.53 53.22,18.87 55.87,18.87 56.55,19.55 56.55,20.68 57.37,21.5 59.05,21.5 59.51,21.96 U1.30 | U1.30 | v68.27,11.67 72.08,11.67 72.74,12.33 72.74,14.44 C1.1 72.76,17.65 | RESET.3 72.76,18.06 72.76,17.65 | MEGA_PROG.5 44.47,48.3 45.72,47.05 48.97,47.05 v49.67,46.35 | v64.52,28.9 64.52,26.42 63.57,25.47 v62.55,25.47 v62.56,25.48 62.56,26.34 62.52,26.38 59.92,26.38 59.83,26.29 59.83,25.67 59.51,25.35 U1.30 | 72.76,17.65 73.9,16.51 79.53,16.51 RESET.4 | C7.2 11.16,8.33 11.62,7.87 19.79,7.87 v20.5,8.58
  Bottom 0.254: D3.A 28.17,11.27 v27.25,10.35 v27.24,10.34 27.24,9.2 26.62,8.58 v20.5,8.58 | v62.55,25.47 62.55,21.94 63.44,21.05 63.44,13.45 64.38,12.51 67.43,12.51 v68.27,11.67 | v49.67,46.35 49.67,35.21 51.8,33.08 51.8,30.68 52.54,29.94 63.48,29.94 v64.52,28.9
RESET1  (via drill 0.6)
  Top 0.254: R6.1 102.89,69.06 104.48,70.65 112.06,70.65 S2.4 112.13,70.62 112.13,71.84 113.32,73.03 119.48,73.03 | S2.3 120.51,72 119.48,73.03 | TEMP_PROG.5 89.78,72.38 90.23,72.83 97.64,72.83 100.03,70.44 R6.1 | U4.29 92.04,55.11 v91.98,55.17 | 99.9,69.18 R6.1 | v97.99,69.07 R6.1 | v121.1,73.18 119.63,73.18 119.48,73.03
  Bottom 0.254: v91.98,55.17 91.98,56.3 92.37,56.69 93.12,56.69 93.69,57.26 93.69,62.66 94.28,63.25 97.1,63.25 97.62,63.77 97.62,68.7 v97.99,69.07 | C23.2 121.39,72.89 v121.1,73.18
RESET1SD  (via drill 0.6)
  Top 0.254: U5.29 106.81,36.6 | 106.81,36.6 103.92,36.6 v103.67,36.35 | S1.3 111.33,33.4 110.03,32.1 108.72,32.1 107.22,33.6 107.22,36.19 106.81,36.6 | S1.4 S1.3 | v112.52,35.15 112.52,33.48 S1.3
  Bottom 0.254: v103.67,36.35 94.25,36.35 93.41,37.19 91.27,37.19 SD_PROG.5 | R22.1 113.15,35.78 v112.52,35.15
RX_MEGA  (via drill 0.6)
  Top 0.254: U1.2 52.87,35.99 49.76,32.88 49.76,31.47 49.41,31.12 36.2,31.12 36.2,31.05 J5.2 | v29.7,28.72 29.12,28.14 R20.1 26.68,28.02 v26.68,23.44
  Bottom 0.254: v29.7,28.72 29.7,31.35 30.17,31.82 34.11,31.82 J5.2 | IC1.26 15.87,11.78 17.09,10.56 22.94,10.56 24.18,11.8 24.18,22.8 24.57,23.19 26.43,23.19 v26.68,23.44
RXCAN  (via drill 0.6)
  Top 0.254: v37.19,12.38 36.99,12.38 36.83,12.22 U3.2
  Bottom 0.254: U6.4 42.55,13.97 41.61,13.04 37.85,13.04 v37.19,12.38
RXI_TMP  (via drill 0.6)
  Top 0.254: U4.30 92.84,51.3 v92.43,50.89 | v53.69,31.57 53.69,30.67 50.83,27.81 41.69,27.81 39.29,25.41 35.64,25.41 J5.6
  Bottom 0.254: v53.69,31.57 54.09,31.97 62.83,31.97 65.6,34.74 65.6,40.94 74.21,49.55 81.47,49.55 82.81,50.89 v92.43,50.89 92.7,50.62 106.63,50.62 107.72,51.71 107.72,59.27 110.22,61.77 115.79,61.77 117.42,63.4 117.42,66.48 118.5,67.56 122.61,67.56 123.21,66.96 IC2.26
RXISD  (via drill 0.6)
  Top 0.254: v54.25,34.62 54.17,34.7 53.27,34.7 51.49,32.92 51.49,30.86 49.83,29.2 49.82,29.21 47.8,29.21 47.5,29.51 v43.79,29.51 | v63.38,33.93 63.38,31.47 65.3,29.55 66.57,29.55 v68.7,27.42 | v78.21,27.57 88.99,27.57 90.85,25.71 92.79,25.71 95.24,28.16 95.24,30.41 95.94,31.11 99.12,31.11 v99.99,31.98 | v97.81,35.51 97.81,39.02 98.89,40.1 99.83,40.1 99.85,40.12 100.74,40.12 102.09,38.77 102.09,37.86 102.56,37.39 U5.30
  Bottom 0.203: 34.2,26.65 40.92,26.65
  Bottom 0.254: v54.25,34.62 60.61,34.62 61.59,33.64 63.09,33.64 v63.38,33.93 | v68.7,27.42 78.06,27.42 v78.21,27.57 | v99.99,31.98 99.99,35.45 100.04,35.5 v97.82,35.5 v97.81,35.51 | 34.2,26.65 J5.3 | 40.92,26.65 v43.79,29.51
SCK
  Top 0.254: TEMP_PROG.7 87.06,70.57 85.96,69.47 85.96,60.78 85.36,60.18 R7.1 | U4.17 84.61,60.2 R7.1 | R7.1 84.58,61.02 84.29,61.31 81.89,61.31 81.27,61.93 81.27,63.3 79.79,64.78 74.63,64.78 73.07,66.35 64.79,66.35 J1.6 63.52,65.08 60.42,65.08 59.15,66.35 55.74,66.35 J2.6 54.47,65.08 50.61,65.08 49.22,66.47 J3.6 44.3,65.18 40.61,65.18 39.43,66.35 J4.6
SCKSD  (via drill 0.6)
  Top 0.254: R23.1 103.78,24 102.61,25.17 99.63,25.17 v99.08,25.72 101.23,27.87 101.23,30.17 101.85,30.79 U5.17
  Bottom 0.254: v99.08,25.72 99.08,27.82 U2.15 99.04,29.04 98.23,29.86 88.55,29.86 87.06,31.35 87.06,34.09 88.91,35.94 SD_PROG.7
SCKSD1  (via drill 0.6)
  Top 0.254: v99.13,23.94 99.13,21.14 98.87,20.88 98.87,19.77 99.41,19.23 99.41,16.42 SD1.5
  Bottom 0.254: U2.6 99.04,23.86 v99.13,23.94
SCL  (via drill 0.6)
  Top 0.254: U1.43 65.99,27.46 v65.76,27.69
  Bottom 0.254: v65.76,27.69 65.4,27.69 64.82,27.11 64.82,21.02 R3.1 66.45,20.65 66.9,20.2 66.9,14.4 67.7,13.6 68.5,13.6 69.3,12.8 69.3,11.2 68.3,10.2 68.3,9.35 U$1.P$1
SDA  (via drill 0.6)
  Top 0.254: U1.44 66.5,24.72 66.98,25.2 67.3,25.2 v67.57,24.93
  Bottom 0.254: v67.57,24.93 68.39,24.11 R4.1 69.77,20.63 70.3,20.1 70.3,9.71 U$1.P$2
TMP_FD0  (via drill 0.6)
  Top 0.203: 93.64,60.55 93.64,60.34 93.22,59.92 92.79,59.92 v92.56,59.69
  Top 0.254: U1.42 65.51,21.99 66.38,21.12 68.06,21.12 68.46,20.72 | 68.46,20.72 R10.1 | U4.10 93.64,60.55 | R9.2 v81.34,51 81.58,50.76 83.91,50.76 86.22,48.45 v86.22,42.54 | 68.47,20.73 68.46,20.72 | v70.5,21.8 69.42,20.72 68.46,20.72
  Bottom 0.203: v92.56,59.69 90.03,59.69 89.91,59.57
  Bottom 0.254: 89.91,59.57 v81.34,51 | v86.22,42.54 85.69,43.07 83.97,43.07 83.94,43.04 83.94,29.97 77.29,23.32 70.71,23.32 70.5,23.11 v70.5,21.8
TMP_FD1  (via drill 0.6)
  Top 0.254: R15.1 65.76,20.49 65,21.25 U1.41 65,24 64.44,24.56 63.72,24.56 v63.68,24.52 | v82.25,53.26 R21.2 76.94,53.28 76.94,54.33 76.34,54.93 68.86,54.93 68.54,54.61 68.54,49.43 69.26,48.71 69.26,43.68 v70.66,42.28 | U4.9 94.44,63.39 95.06,64.01 95.88,64.01 v96.18,64.32
  Bottom 0.254: v82.25,53.26 89.45,60.46 92.21,60.46 92.96,61.21 92.96,62.98 94.29,64.32 v96.18,64.32 | v63.68,24.52 63.68,26 64.26,26.58 64.26,27.98 64.37,28.09 64.94,28.09 65.71,28.86 65.71,30.6 69.24,34.13 69.23,41.18 70.33,42.28 v70.66,42.28
TX_MEGA  (via drill 0.6)
  Top 0.254: 26.86,30.48 R13.2 | U1.3 53.09,35.48 50.26,32.65 50.26,31.25 49.61,30.6 38.69,30.6 v37.31,29.22
  Top 0.406: 26.86,30.48 33,30.48 J5.1
  Bottom 0.254: v37.31,29.22 36.31,29.22 36.22,29.13 34.26,29.13 J5.1 32.46,29.85 31.02,29.85 30.78,29.61 30.78,25.94 30.19,25.35 23.74,25.35 23.47,25.08 23.47,11.92 22.73,11.18 17.28,11.18 16.37,12.09 IC1.25
TXCAN  (via drill 0.6)
  Top 0.254: v35.56,11.38 U3.1
  Bottom 0.254: U6.1 38.73,14.33 38.37,13.97 36.41,13.97 35.56,13.12 v35.56,11.38
TXO_TMP  (via drill 0.6)
  Top 0.254: U4.31 93.64,49.69 v93.17,49.22 | v59.68,30.86 59.68,33.17 v59.29,33.56 | v53.43,33.53 52.68,32.78 52.68,30.67 50.46,28.45 41.37,28.45 39.59,26.67 36.31,26.67 36.23,26.59 34.28,26.59 J5.5
  Bottom 0.254: v59.68,30.86 60.19,31.37 63.84,31.37 66.57,34.1 66.57,40.47 74.59,48.49 81.93,48.49 82.66,49.22 v93.17,49.22 93.43,49.48 107.56,49.48 109.01,50.93 109.01,59.2 110.75,60.94 116.3,60.94 118.21,62.85 118.21,66.03 118.8,66.62 122.61,66.62 122.71,66.52 IC2.25 | v59.29,33.56 53.46,33.56 v53.43,33.53
TXOSD  (via drill 0.6)
  Top 0.254: U5.31 107.89,38.2 v107.33,38.76 | v67.33,30.77 64.95,30.77 64.6,31.12 64.6,34.79 v64.18,35.21 | v38.36,35.9 38.36,36.59 38.85,37.08 49.69,37.08 v50.81,35.96 | v38.47,27.94 35.63,27.94 J5.4
  Bottom 0.254: v107.33,38.76 v107.32,38.76 106.21,37.65 105.69,37.65 105,38.34 105,41.85 106,42.85 106,46.13 104.64,47.49 89.05,47.49 85.98,44.42 80.98,44.42 v67.33,30.77 | v38.47,27.94 40.31,27.94 44.68,32.31 44.68,34.22 44.04,34.86 39.4,34.86 v38.36,35.9 | v50.81,35.96 60.82,35.96 61.58,35.2 v64.17,35.2 v64.18,35.21
VCC  (via drill 0.6)
  Top 0.203: U4.6 96.82,58.6 97.16,58.27 97.16,57.43 96.72,57
  Top 0.254: U$3.12 32.53,47.28 v32.67,47.14 | v32.67,47.14 33.31,47.78 U$3.6 U$3.7 U$3.8 36.37,48.78 37.5,49.91 37.5,50.73 37.72,50.95 39.1,50.95 R18.2 | C2.2 30.94,48.84 U$3.9 32.23,48.78 32.68,48.33 v32.68,47.15 v32.67,47.14 | v27.22,14.37 27.42,14.17 R14.2 29.1,14.23 30.48,14.23 30.59,14.34 30.59,18.13 30.83,18.37 R32.1 33.14,18.49 U3.18 | 68.44,16.21 R15.2 65.76,14.76 v65.12,14.12 | 68.44,16.21 R10.2 | v73.01,29.34 72.86,29.49 U1.61 69.89,29.49 68.85,30.53 68.85,33.77 67.55,35.07 v67.55,35.93 67.49,35.99 U1.80 | U1.10 57.22,31.98 57.47,32.23 57.47,38.06 | 57.47,38.06 U1.100 | 57.47,38.06 56.53,38.06 v56.02,37.55 55.73,37.84 R12.2 | U5.18 102.65,33.78 v102.78,33.91 | U5.6 103.45,39.38 103.62,39.21 | 103.62,39.21 104.82,39.21 105.05,39.44 U5.4 | 103.62,39.21 103.62,38.87 104.4,38.09 105.26,38.09 v105.9,38.73 | U4.6 92.24,58.6 | 92.24,58.6 91.43,59.41 U4.18 | U4.6 92.89,58.6 | 92.24,58.6 92.24,58.05 v91.98,57.79 | TEMP_PROG.2 96.63,66.26 R6.2 106.87,66.26 R8.2 | SW1.1 SW1.2 67.1,55.9 v65.9,57.1 | U1.31 60,24.04 60.55,24.6 v60.94,24.6 | C11.2 123.09,47.22 C4.1 121.11,47.2 v120.32,46.41 | R40.2 119.27,47.46 v120.32,46.41 | DS1307.8 120.02,46.11 v120.32,46.41 | v120.32,46.41 122.43,44.3 C5.1 C6.1 | U4.6 96.67,58.6 | 96.72,57 U4.4 | 68.44,16.21 68.44,15.06 v68.9,14.6
  Bottom 0.254: v32.67,47.14 32.73,47.14 32.91,46.96 | v27.22,14.37 27.22,14.4 | v65.12,14.12 64.74,14.12 64.25,13.63 | v73.01,29.34 73.04,29.34 | v67.55,35.93 67.67,35.93 | v56.02,37.55 55.56,37.55 55.35,37.76 | v102.78,33.91 v102.79,33.92 103.17,33.92 103.45,34.2 | v105.9,38.73 105.9,38.62 106.15,38.37 | 92.37,57.68 92.35,57.7 v91.98,57.79 91.98,57.16 91.89,57.07 | v120.32,46.41 120.32,45.87 120.75,45.44 | v65.9,57.1 65.75,57.1 65.7,57.15 | v68.9,14.6 69.2,14.6 69.5,14.3
  pour Bottom: -11.3,88.9 160.6,98.4 144.62,-13.19 -12.28,-12.69 -10.8,34.5 31.3,34.5 31.3,53.8 -11.3,53.8
XTAL1
  Top 0.254: R1.1 61.19,13.96 Y1.2 61.49,16.35 U1.34
  Bottom 0.254: C12.2 62.34,16.49 61.85,16 61.24,16 Y1.2
XTAL2
  Top 0.254: R1.2 56.11,13.82 Y1.1 57.4,17.34 57.4,18.07 59.3,19.97 60.43,19.97 61.01,20.55 U1.33
  Bottom 0.254: Y1.1 56.11,18.82 C13.2
XTAL11
  Top 0.254: U4.7 100.9,59.4 101.78,58.52 Y3.2
  Bottom 0.254: C20.2 99.65,58.08 Y3.2
XTAL11SD
  Top 0.254: U5.7 102.65,44.38 Y2.2
  Bottom 0.254: Y2.2 103.24,40.72 C21.2
XTAL21
  Top 0.254: U4.8 100.93,60.2 Y3.1
  Bottom 0.254: C18.2 101.31,60.58 Y3.1
XTAL21SD
  Top 0.254: U5.8 101.02,40.49 99.68,41.83 99.68,44.18 98.89,44.97 Y2.1
  Bottom 0.254: C17.2 98.22,44.91 Y2.1
XVCC  (via drill 0.6)
  Top 0.254: v12.92,17.83 9.79,17.83 9.43,17.47 9.43,16.98 9,16.55 CN1.VBUS
  Bottom 0.203: v12.92,17.83 12.57,18.18 12.57,21.01 12.85,21.29 17.83,21.29 18.92,22.38 J6.2
  Bottom 0.254: IC1.8 IC1.7 13.5,16.45 13.13,16.82 13.13,17.62 v12.92,17.83
XVCC1  (via drill 0.6)
  Top 0.203: J7.2 135.43,56.41 134.75,57.1 127.08,57.1 126.44,57.73 126.44,61.46 v127.04,62.06
  Top 0.254: v127.04,62.06 131.28,62.06 CN2.VBUS | C26.2 129,55.17 127.08,57.1
  Bottom 0.254: v127.04,62.06 IC2.7 IC2.8

## Text on the board
tPlace: v2.0 | BMS Slave | Vehicle | ENERGY METER | CR2032 | SHUTDOWN | D:/E/Team Ojas/Pedal.bmp